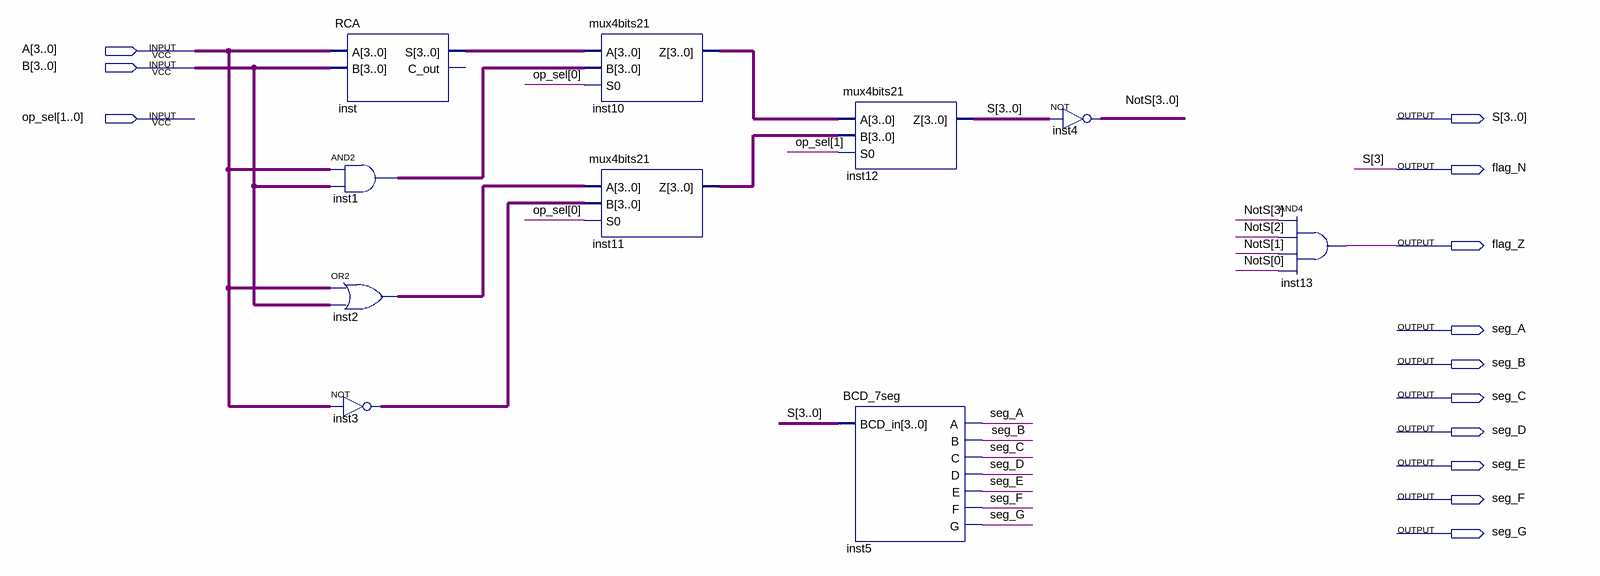
[diagram p0: schematic sheet]
// Quartus schematic ula.bdf as structural Verilog: 10 symbols, 13 pins
module ula (
  input  [3:0] A,
  input  [3:0] B,
  input  [1:0] op_sel,
  output [3:0] S,
  output flag_N,
  output flag_Z,
  output seg_A,
  output seg_B,
  output seg_C,
  output seg_D,
  output seg_E,
  output seg_F,
  output seg_G
);

  wire [3:0] inst1_out, inst2_out, inst3_out, inst10_z, inst11_z, inst_s, NotS;

  RCA inst (.A(A), .B(B), .S(inst_s));  // open: C_out
  assign inst1_out = A & B;  // AND2 inst1, 4 bits wide
  assign inst2_out = A | B;  // OR2 inst2, 4 bits wide
  assign inst3_out = ~A;  // NOT inst3, 4 bits wide
  mux4bits21 inst10 (.A(inst_s), .B(inst1_out), .S0(op_sel[0]), .Z(inst10_z));
  mux4bits21 inst11 (.A(inst2_out), .B(inst3_out), .S0(op_sel[0]), .Z(inst11_z));
  mux4bits21 inst12 (.A(inst10_z), .B(inst11_z), .S0(op_sel[1]), .Z({flag_N, S[2:0]}));
  BCD_7seg inst5 (
    .BCD_in({flag_N, S[2:0]}), .A(seg_A), .B(seg_B), .C(seg_C), .D(seg_D), .E(seg_E), .F(seg_F), .G(seg_G));
  assign NotS = ~{flag_N, S[2:0]};  // NOT inst4, 4 bits wide
  and inst13 (flag_Z, NotS[3], NotS[2], NotS[1], NotS[0]);

  assign S[3] = flag_N;
endmodule
